# EAGLE schematic RPiHeating (EAGLE 7.5.0)
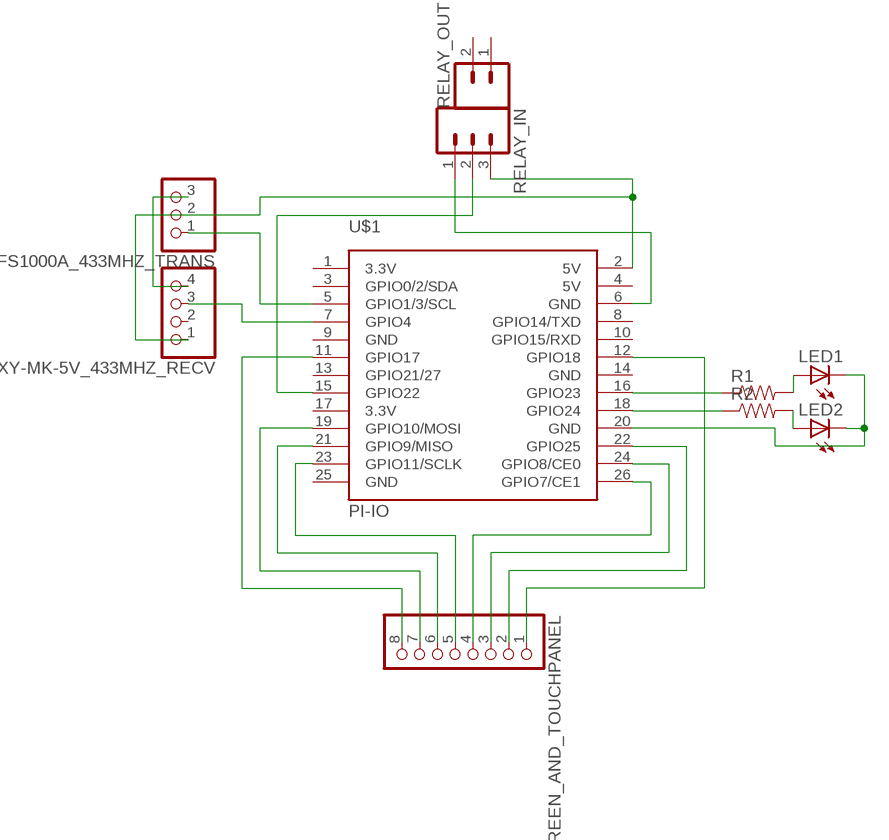
[diagram p0: schematic, sheet 1]

## Parts
FS1000A_433MHZ_TRANS  PINHD-1X3  [1X03]
LED1  LED5MM  [LED5MM]
LED2  LED5MM  [LED5MM]
R1  SPARKFUN_RESISTORPTH-1/4W  [SPARKFUN_AXIAL-0.4]
R2  SPARKFUN_RESISTORPTH-1/4W  [SPARKFUN_AXIAL-0.4]
RELAY_IN  M03-SCREW-5MM  [SCREWTERMINAL-5MM-3]
RELAY_OUT  M02JST-PTH-2  [JST-2-PTH]
SCREEN_AND_TOUCHPANEL  PINHD-1X8/90  [1X08/90]
U$1  PI-IO  [13X2-PTH]
XY-MK-5V_433MHZ_RECV  PINHD-1X4  [1X04]

## Nets
N$1: R2.P$1 U$1.18(GPIO24)
N$2: R1.P$1 U$1.16(GPIO23)
N$3: LED1.A R1.P$2
N$4: LED2.A R2.P$2
N$5: FS1000A_433MHZ_TRANS.3 XY-MK-5V_433MHZ_RECV.4
N$6: RELAY_IN.2 U$1.15(GPIO22)
N$7: RELAY_IN.1 U$1.6(GND)
N$8: LED1.K(C) LED2.K(C) U$1.20(GND)
N$9: FS1000A_433MHZ_TRANS.1 U$1.5(GPIO1/3/SCL)
N$10: RELAY_IN.3 U$1.2(5V) XY-MK-5V_433MHZ_RECV.1
N$11: SCREEN_AND_TOUCHPANEL.5 U$1.23(GPIO11/SCLK)
N$12: U$1.7(GPIO4) XY-MK-5V_433MHZ_RECV.3
N$13: SCREEN_AND_TOUCHPANEL.6 U$1.21(GPIO9/MISO)
N$14: SCREEN_AND_TOUCHPANEL.7 U$1.19(GPIO10/MOSI)
N$15: SCREEN_AND_TOUCHPANEL.8 U$1.11(GPIO17)
N$16: SCREEN_AND_TOUCHPANEL.4 U$1.26(GPIO7/CE1)
N$17: SCREEN_AND_TOUCHPANEL.3 U$1.24(GPIO8/CE0)
N$18: SCREEN_AND_TOUCHPANEL.2 U$1.22(GPIO25)
SCREEN_AND_TOUCHPANEL: SCREEN_AND_TOUCHPANEL.1 U$1.12(GPIO18)
Unconnected: FS1000A_433MHZ_TRANS.2 RELAY_OUT.1 RELAY_OUT.2 U$1.3(GPIO0/2/SDA) U$1.8(GPIO14/TXD) U$1.10(GPIO15/RXD) U$1.13(GPIO21/27) XY-MK-5V_433MHZ_RECV.2

## Power pins joined to a net without a drawn wire
3.3V: U$1.1(3.3V) U$1.17(3.3V)
5V: U$1.4(5V)
GND: U$1.9(GND) U$1.14(GND) U$1.25(GND)

## Library data of the parts
FS1000A_433MHZ_TRANS = pinhead:PINHD-1X3: PIN HEADER
LED1 LED2 = adafruit:LED: LED OSRAM: - CHIPLED LG R971, LG N971, LY N971, LG Q971, LY Q971, LO R971, LY R971 LH N974, LH R974 LS Q976, LO Q976, LY Q976 LO Q996 - Hyper CHIPLED LW Q18S LB Q993, LB Q99A, LB R99A - SideLED LS A670, LO A670, LY A670, LG A670, LP A670 LB A673, LV A673, LT A673, LW A673 LH A674 LY A675 LS A676, LA A676, LO A676, LY A676, LW A676 LS A679, LY A679, LG A679 - Hyper Micro SIDELED® LS Y876, LA Y876, LO Y876, LY Y876 LT Y87S - SmartLED LW L88C, LW L88S LB L89C, LB L89S, LG L890 LS L89K, LO L89K, LY L89K LS L896, LA L896, LO L896, LY L896 - TOPLED LS T670, LO T670, LY T670, LG T670, LP T670 LSG T670, LSP T670, LSY T670, LOP T670, LYG T670 LG T671, LOG T671, LSG T671 LB T673, LV T673, LT T673, LW T673 LH T674 LS T676, LA T676, LO T676, LY T676, LB T676, LH T676, LSB T676, LW T676 LB T67C, LV T67C, LT T67C, LS T67K, LO T67K, LY T67K, LW E67C LS E67B, LA E67B, LO E67B, LY E67B, LB E67C, LV E67C, LT E67C LW T67C LS T679, LY T679, LG T679 LS T770, LO T770, LY T770, LG T770, LP T770 LB T773, LV T773, LT T773, LW T773 LH T774 LS E675, LA E675, LY E675, LS T675 LS T776, LA T776, LO T776, LY T776, LB T776 LHGB T686 LT T68C, LB T68C - Hyper Mini TOPLED® LB M676 - Mini TOPLED Santana® LG M470 LS M47K, LO M47K, LY M47K Source: http://www.osram.convergy.de/
R1 R2 = DECADE-libraries:SPARKFUN_RESISTOR: Resistor Basic schematic elements and footprints for 0603, 1206, and PTH resistors.
RELAY_IN = DECADE-libraries:M03: Header 3 Standard 3-pin 0.1" header. Use with straight break away headers (SKU : PRT-00116), right angle break away headers (PRT-00553), swiss pins (PRT-00743), machine pins (PRT-00117), and female headers (PRT-00115). Molex polarized connector foot print use with SKU : PRT-08232 with associated crimp pins and housings.
RELAY_OUT = DECADE-libraries:M02: Header 2 Standard 2-pin 0.1" header. Use with straight break away headers (SKU : PRT-00116), right angle break away headers (PRT-00553), swiss pins (PRT-00743), machine pins (PRT-00117), and female headers (PRT-00115). Molex polarized connector foot print use with SKU : PRT-08233 with associated crimp pins and housings.
SCREEN_AND_TOUCHPANEL = pinhead:PINHD-1X8: PIN HEADER
U$1 = GeekAmmo:PI-IO: Raspberry Pi IO connector
XY-MK-5V_433MHZ_RECV = pinhead:PINHD-1X4: PIN HEADER